# Altium schematic sheet V1.SchDoc
size 558 x 431 mm; SheetNumber: 1; SheetTotal: 1
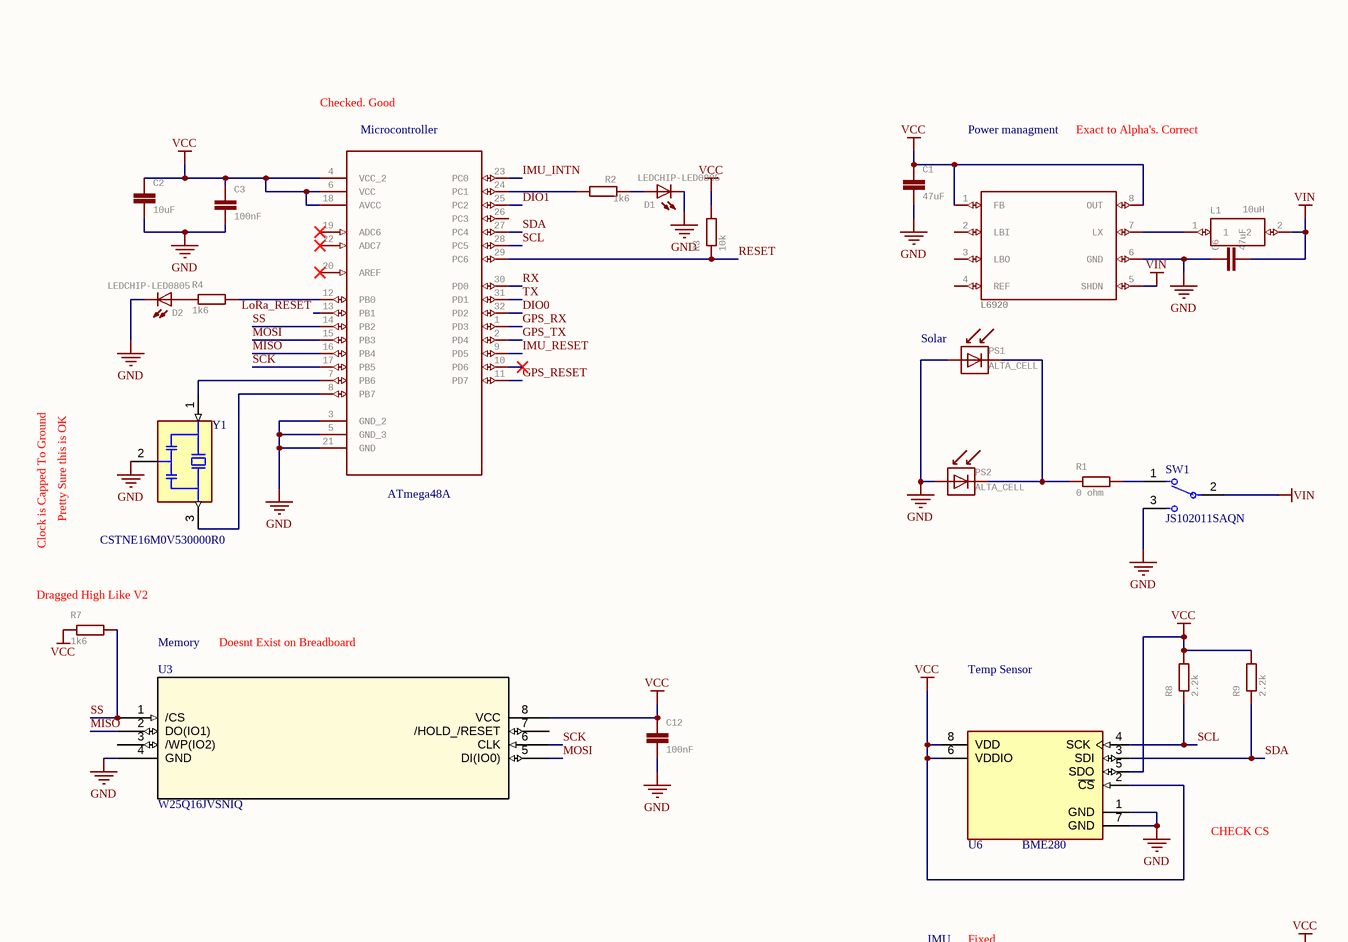
[diagram p0: V1.SchDoc, top left]
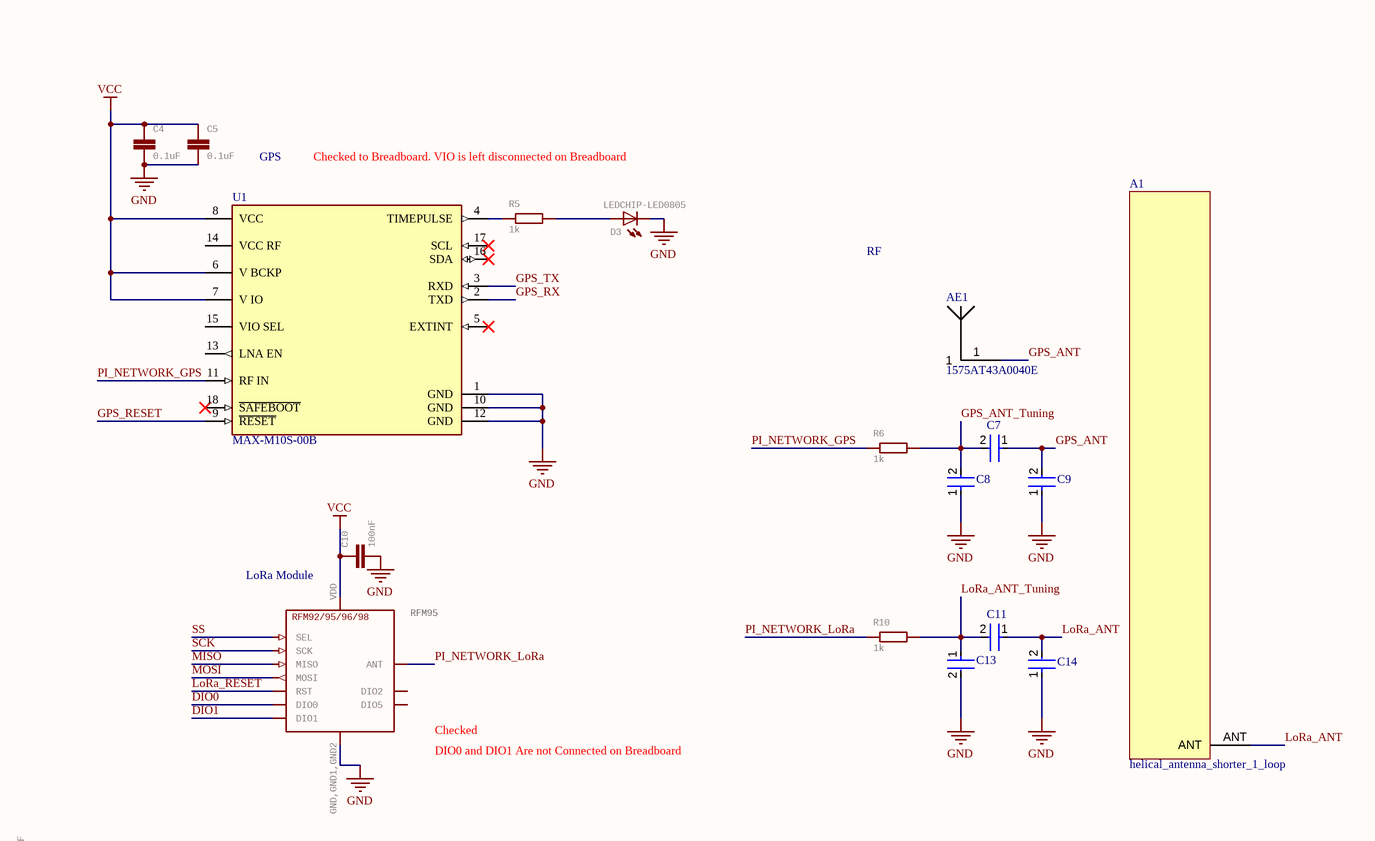
[diagram p1: V1.SchDoc, top right]
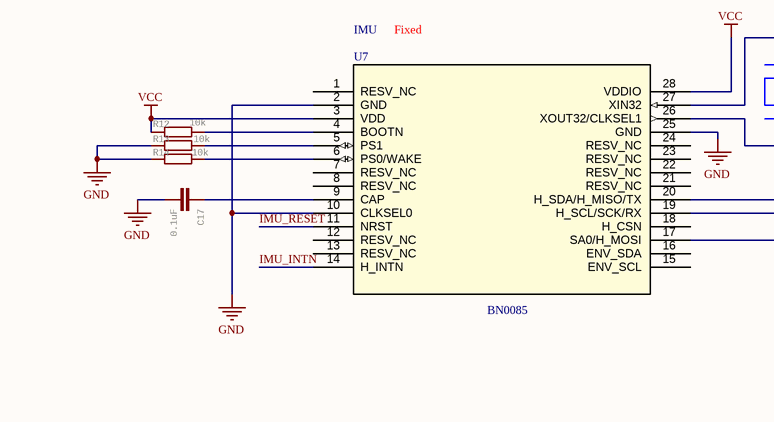
[diagram p2: V1.SchDoc, bottom left]
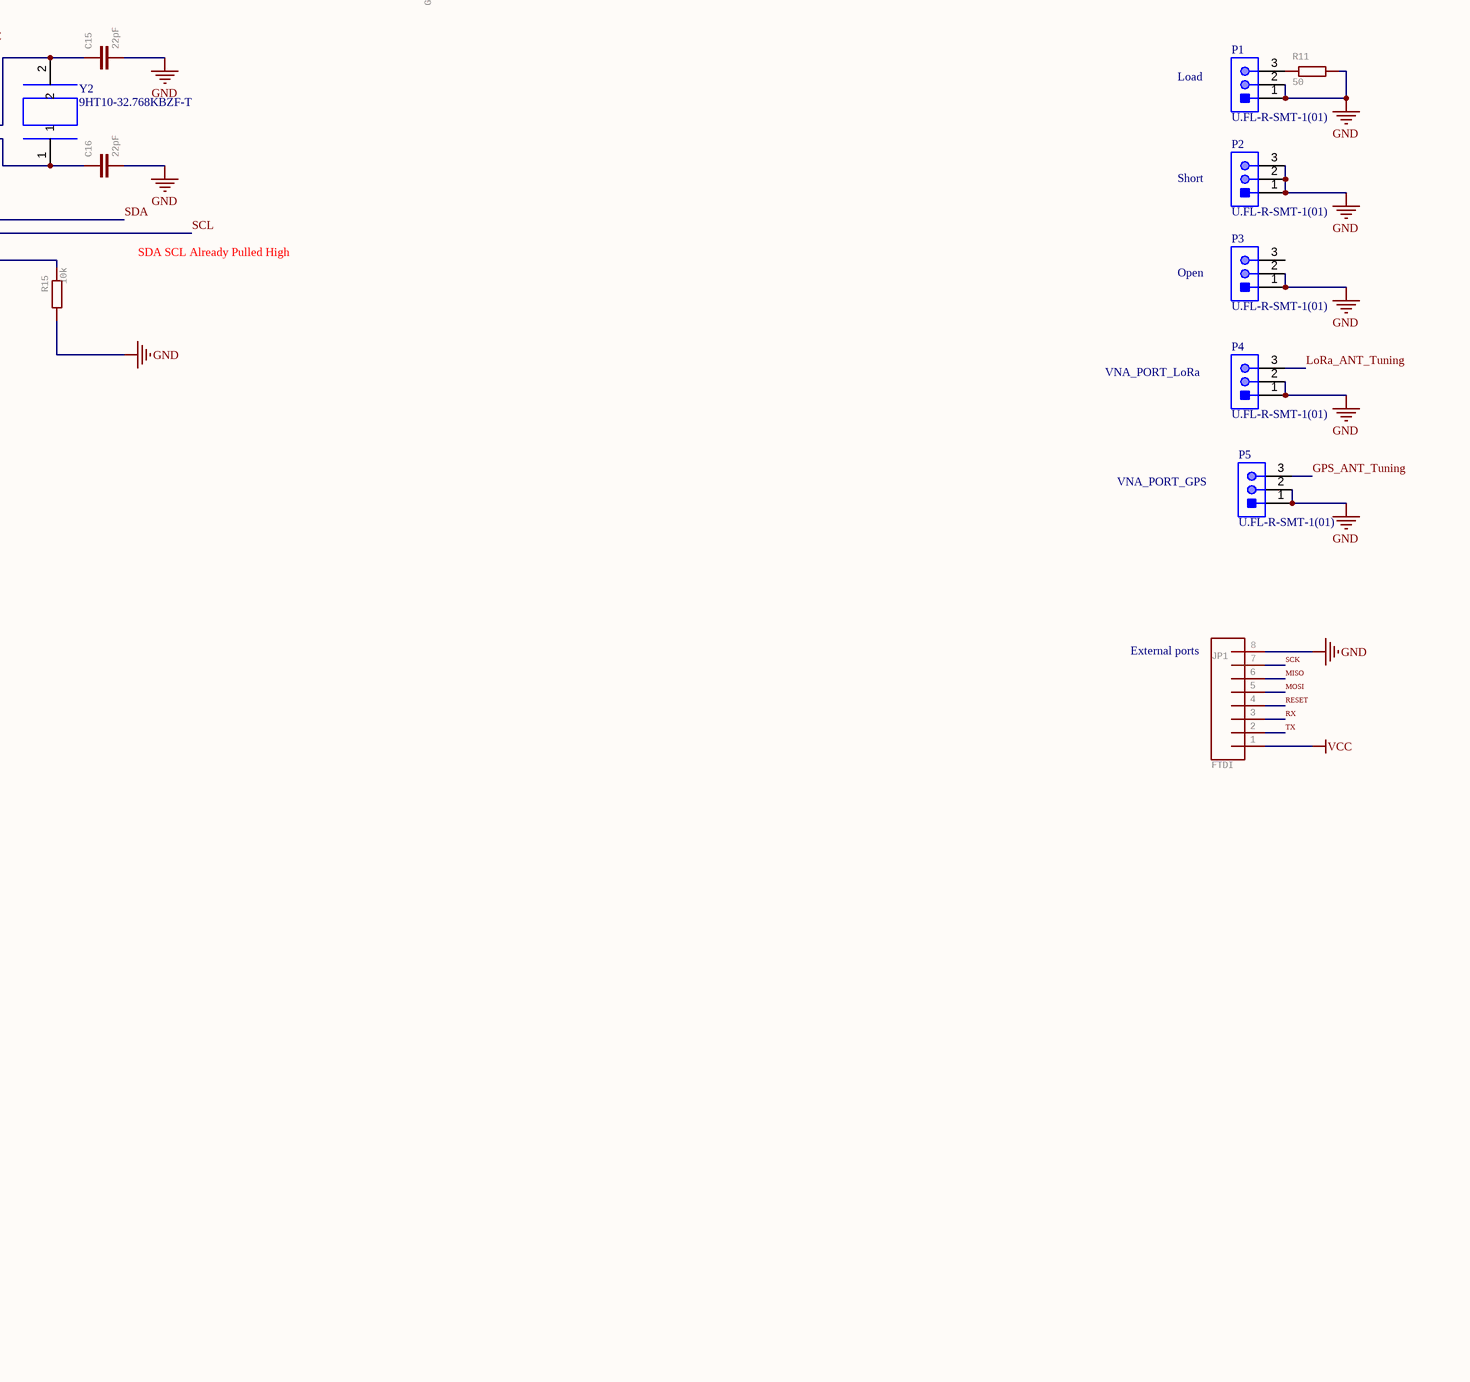
[diagram p3: V1.SchDoc, bottom right]

## Parts
A1  helical_antenna_shorter_1_loop  [LoRa_ANT_915_shorter_1_loop]
AE1  1575AT43A0040E  [ANT_1575AT_JOT-L]
C1  47uF  [RCL_M0805]
C2  10uF  [0402]
C3  100nF  [0402]
C4  0.1uF  [0402]
C5  0.1uF  [0402]
C6  47uF  [RCL_M0805]
C7  C0402C223K8PACTU  [PI_NET_CAPACITOR_0402NO_EXPANSION]  (value not drawn)
C8  C0402C223K8PACTU  [PI_NET_CAPACITOR_0402NO_EXPANSION]  (value not drawn)
C9  C0402C223K8PACTU  [PI_NET_CAPACITOR_0402NO_EXPANSION]  (value not drawn)
C10  100nF  [0402]
C11  C0402C223K8PACTU  [PI_NET_CAPACITOR_0402NO_EXPANSION]  (value not drawn)
C12  100nF  [0402]
C13  C0402C223K8PACTU  [PI_NET_CAPACITOR_0402NO_EXPANSION]  (value not drawn)
C14  C0402C223K8PACTU  [PI_NET_CAPACITOR_0402NO_EXPANSION]  (value not drawn)
C15  22pF  [0402]
C16  22pF  [0402]
C17  0.1uF  [0402]
D1  LEDCHIP-LED0805  [0402]
D2  LEDCHIP-LED0805  [0402]
D3  LEDCHIP-LED0805  [0402]
JP1  FTDI  [1X08_OVAL]
L1  10uH  [Inductor_For_6920]
P1  U.FL-R-SMT-1(01)  [HRS-U.FL-R-SMT-3_V]
P2  U.FL-R-SMT-1(01)  [HRS-U.FL-R-SMT-3_V]
P3  U.FL-R-SMT-1(01)  [HRS-U.FL-R-SMT-3_V]
P4  U.FL-R-SMT-1(01)  [HRS-U.FL-R-SMT-3_V]
P5  U.FL-R-SMT-1(01)  [HRS-U.FL-R-SMT-3_V]
PS1  ALTA_CELL  [ALTA_CELL_SAME_SIZED_FEET]
PS2  ALTA_CELL  [ALTA_CELL_SAME_SIZED_FEET]
R1  0 ohm  [RCL_M0805]
R2  1k6  [0402]
R3  10k  [0402]
R4  1k6  [0402]
R5  1k  [0402]
R6  1k  [0402]
R7  1k6  [0402]
R8  2.2k  [0402]
R9  2.2k  [0402]
R10  1k  [0402]
R11  50  [0402]
R12  10k  [0402]
R13  10k  [0402]
R14  10k  [0402]
R15  10k  [0402]
SW1  JS102011SAQN  [FP-JS102011SAQN-MFG]
U1  MAX-M10S-00B  [FP-MAX-M10S-00B-MFG - duplicate]
U2  ATMEL-ATMEGA328P-AU_ATMEGA328P-AU  [ATMEL-ATMEGA328P-AU_QFP80P900X900X120-32N]  (value not drawn)
U3  W25Q16JVSNIQ  [SOIC_150MIL_WIN]
U4  L6920  [L6920_L6920]
U5  RFM95  [_C2H_RFM95]
U6  d58e2f6669bc67e6a2bc6a28610ca79  [FP-BME280-MFG]  (value not drawn)
U7  BN0085  [QFN28_BNO086_CEV]
Y1  CSTNE16M0V530000R0  [OSC_CSTNE16M0V530000R0]
Y2  9HT10-32.768KBZF-T  [XTAL_9HT10_TXC]

## Nets
GND: C1.2 C2.2 C3.2 C4.2 C5.2 C6.1 C8.1 C9.1 C10.2 C12.2 C13.2 C14.1 C15.2 C16.2 C17.2 D1.2(C) D2.2(C) D3.2(C) JP1.8 P1.1 P1.2 P2.1 P2.2 P2.3 P3.1 P3.2 P4.1 P4.2 P5.1 P5.2 PS1.- PS2.- R11.2 R13.2 R14.2 R15.2 SW1.3 U1.1(GND) U1.10(GND) U1.12(GND) U2.3(GND_2) U2.5(GND_3) U2.21(GND) U3.4(GND) U4.6(GND) U5.GND,GND1,GND2(GND) U6.1(GND) U6.7(GND) U7.2(GND) U7.10(CLKSEL0) U7.25(GND) Y1.2(GND)
VCC: C1.1 C2.1 C3.1 C4.1 C5.1 C10.1 C12.1 JP1.1 R3.2 R7.1 R8.2 R9.2 R12.2 U1.6(V_BCKP) U1.7(V_IO) U1.8(VCC) U2.4(VCC_2) U2.6(VCC) U2.18(AVCC) U3.8(VCC) U4.1(FB) U4.8(OUT) U5.VDD(VCC) U6.2(~{CS}) U6.5(SDO) U6.6(VDDIO) U6.8(VDD) U7.3(VDD) U7.28(VDDIO)
VIN: C6.2 L1.2 SW1.2(C) U4.5(SHDN)
DIO0: U2.32(PD2) U5.DIO0
DIO1: U2.25(PC2) U5.DIO1
GPS_ANT: AE1.1 C7.1 C9.2
GPS_ANT_Tuning: C7.2 C8.2 P5.3 R6.2
GPS_RESET: U1.9(~{RESET}) U2.11(PD7)
GPS_RX: U1.2(TXD) U2.1(PD3)
GPS_TX: U1.3(RXD) U2.2(PD4)
IMU_INTN: U2.23(PC0) U7.14(H_INTN)
IMU_RESET: U2.9(PD5) U7.11(NRST)
LoRa_ANT: A1.ANT C11.1 C14.2
LoRa_ANT_Tuning: C11.2 C13.1 P4.3 R10.2
LoRa_RESET: U2.13(PB1) U5.RST
MISO: JP1.6 U2.16(PB4) U3.2(DO(IO1)) U5.MISO
MOSI: JP1.5 U2.15(PB3) U3.5(DI(IO0)) U5.MOSI
PI_NETWORK_GPS: R6.1 U1.11(RF_IN)
PI_NETWORK_LoRa: R10.1 U5.ANT
RESET: JP1.4 R3.1 U2.29(PC6)
RX: JP1.3 U2.30(PD0)
SCK: JP1.7 U2.17(PB5) U3.6(CLK) U5.SCK
SCL: R8.1 U2.28(PC5) U6.4(SCK) U7.19(H_SCL/SCK/RX)
SDA: R9.1 U2.27(PC4) U6.3(SDI) U7.20(H_SDA/H_MISO/TX)
SS: R7.2 U2.14(PB2) U3.1(/CS) U5.NSS(SEL)
TX: JP1.2 U2.31(PD1)
NetC15_1: C15.1 U7.27(XIN32) Y2.2
NetC16_1: C16.1 U7.26(XOUT32/CLKSEL1) Y2.1
NetC17_1: C17.1 U7.9(CAP)
NetD1_1: D1.1(A) R2.1
NetD2_1: D2.1(A) R4.1
NetD3_1: D3.1(A) R5.2
NetL1_1: L1.1 U4.7(LX)
NetP1_3: P1.3 R11.1
NetPS1_+: PS1.+ PS2.+ R1.1
NetR1_2: R1.2 SW1.1
NetR2_2: R2.2 U2.24(PC1)
NetR4_2: R4.2 U2.12(PB0)
NetR5_1: R5.1 U1.4(TIMEPULSE)
NetR12_1: R12.1 U7.4(BOOTN)
NetR13_1: R13.1 U7.5(PS1)
NetR14_1: R14.1 U7.6(PS0/WAKE)
NetR15_1: R15.1 U7.17(SA0/H_MOSI)
NetU2_7: U2.7(PB6) Y1.1(IN)
NetU2_8: U2.8(PB7) Y1.3(OUT)

Not connected (* = marked no-connect by the designer): P3 3; U1 5(EXTINT)* 13(LNA_EN) 14(VCC_RF) 15(VIO_SEL) 16(SDA)* 17(SCL)* 18(~{SAFEBOOT})*; U2 10(PD6)* 19(ADC6)* 20(AREF)* 22(ADC7)* 26(PC3); U3 3(/WP(IO2)) 7(/HOLD_/RESET); U4 2(LBI) 3(LBO) 4(REF); U5 DIO2 DIO5; U7 1(RESV_NC) 7(RESV_NC) 8(RESV_NC) 12(RESV_NC) 13(RESV_NC) 15(ENV_SCL) 16(ENV_SDA) 18(H_CSN) 21(RESV_NC) 22(RESV_NC) 23(RESV_NC) 24(RESV_NC)

## Notes on the sheet
- Checked. Good
- (near U2) Microcontroller
- Power managment
- Exact to Alpha's. Correct
- GPS
- Checked to Breadboard. VIO is left disconnected on Breadboard
- RF
- (near PS1) Solar
- Clock is Capped To Ground
- Pretty Sure this is OK
- (near U2) ATmega48A
- (near R7) Dragged High Like V2
- Memory
- Doesnt Exist on Breadboard
- Temp Sensor
- LoRa Module
- (near U5) Checked
- (near U6) BME280
- CHECK CS
- (near U5) DIO0 and DIO1 Are not Connected on Breadboard
- IMU
- Fixed
- Load
- (near P2) Short
- SDA SCL Already Pulled High
- Open
- VNA_PORT_LoRa
- VNA_PORT_GPS
- (near JP1) External ports
- DWG. NO.
- REV.
- SHT.
- REVISION
- DESCRIPTION
- DATE
- APPROVED
- THIS DOCUMENT AND THE DATA DISCLOSED HEREIN OR HEREWITH IS THE PROPERTY OF ALTIUM LIMITED AND MAY BE FREELY DISTRIBUTED IN WHOLE. NO RIGHTS ARE RESERVED OR EXPRESS OR IMPLIED WARANTEE GIVEN.
- ENG:
- DSN:
- APPROVALS
- PROJECT
- DOCUMENT REVISION:
- DESIGN ITEM:
- CHK:
- BOM:
- REFERENCE DOCUMENTS
- PROJECT REVISION:
- TITLE
- FAB DWG:
- PCB DWG:
- ASSY DWG:
- SCALE:
- SIZE
- C
- CAGE CODE
- FILE NAME
- DWG NO.
- SHEET
- OF
- REV

## Library data of the parts
A1 = helical_antenna_shorter_1_loop: helical_antenna schematic for the DeSCENT v1 ChipSat
AE1 = 1575AT43A0040E: No Description Available; Mfr_Name: Johanson Technology; Digi-Key_Part_Number_3: 712-1003-6-ND; Digi-Key_Part_Number_2: 712-1003-1-ND; Digi-Key_Part_Number_1: 712-1003-2-ND
C1 C6 = C-EUC0603K_1: CAPACITOR, European symbol; GateName_1: G$1; SymbolName_1: C-EU; DeviceName: C0805K; LibraryName: rcl; DeviceSetName: C-EU
C2-C5 C15-C17 = C-EUC0805K: CAPACITOR, European symbol; GateName_1: G$1; SymbolName_1: C-EU; DeviceName: C0805K; LibraryName: rcl; DeviceSetName: C-EU
C7-C9 C11 C13 C14 = 0402RFCapacitor_NO_SILK: CAP CER 0.022UF 10V X5R 0402; Manufacturer: Kemet; Capacitance: 22,000 pF; Value: 22,000 pF; Temperature Coefficient: 15%; Material: Ceramic; Tolerance: 0.1; RoHS: TRUE; Octopart: https://octopart.com/c0402c223k8pactu-kemet-140074; Category: Cap; Manufacturer Part Number: C0402C223K8PACTU; Lead Free: Yes; Automotive: No; Height: 0.55mm; Ipc Land Pattern Name: CAPC10050X50; ComponentLink2URL: https://content.kemet.com/datasheets/KEM_C1002_X7R_SMD.pdf; Device Class L2: Capacitors; Temperature Range Low: -55°C; ComponentLink2Description: Datasheet; Mouser Description: Multilayer Ceramic Capacitors MLCC - SMD/SMT 10volts 22000pF X5R 10%; Voltage Rating: 10 V; Device Class L3: Ceramic Capacitors; Package: C0402-BB; Digikey Description: CAP CER 0.022UF 10V X5R 0402; Temperature Characteristic: X5R; Temperature: -55°C to +125°C; Device Class L1: Passive Components; Temperature Range High: +125°C
C10 C12 = RCL_C-EUC0805: GateName_1: G$1; DeviceName: C0805; SymbolName_1: RCL_C-EU; LibraryName: AmbaSat-1v1-01-NO-solar; DeviceSetName: RCL_C-EU; Package: RCL_C0805
D1-D3 = LEDCHIP-LED0805: LED   OSRAM: - CHIPLED LG R971, LG N971, LY N971, LG Q971, LY Q971, LO R971, LY R971 LH N974, LH R974 LS Q976, LO Q976, LY Q976 LO Q996 - Hyper CHIPLED LW Q18S LB Q993, LB Q99A, LB R99A - SideLED LS A670, LO A670, LY A670, LG A670, LP A670 LB A673, LV A673, LT A673, LW A673 LH A674 LY A675 LS A676, LA A676, LO A676, LY A676, LW A676 LS A679, LY A679, LG A679 -  Hyper Micro SIDELEDÂ® LS Y876, LA Y876, LO Y876, LY Y876 LT Y87S - SmartLED LW L88C, LW L88S LB L89C, LB L89S, LG L890 LS L89K, LO L89K, LY L89K LS L896, LA L896, LO L896, LY L896 - TOPLED LS T670, LO T670, LY T670, LG T670, LP T670 LSG T670, LSP T670, LSY T670, LOP T670, LYG T670 LG T671, LOG T671, LSG T671 LB T673, LV T673, LT T673, LW T673 LH T674 LS T676, LA T676, LO T676, LY T676, LB T676, LH T676, LSB T676, LW T676 LB T67C, LV T67C, LT T67C, LS T67K, LO T67K, LY T67K, LW E67C LS E67B, LA E67B, LO E67B, LY E67B, LB E67C, LV E67C, LT E67C LW T67C LS T679, LY T679, LG T679 LS T770, LO T770, LY T770, LG T770, LP T770 LB T773, LV T773, LT T773, LW T773 LH T774 LS E675, LA E675, LY E675, LS T675 LS T776, LA T776, LO T776, LY T776, LB T776 LHGB T686 LT T68C, LB T68C - Hyper Mini TOPLEDÂ® LB M676 - Mini TOPLED SantanaÂ® LG M470 LS M47K, LO M47K, LY M47K    Source: http://www.osram.convergy.de   LUXEON: - LUMILEDÂ® LXK2-PW12-R00, LXK2-PW12-S00, LXK2-PW14-U00, LXK2-PW14-V00 LXK2-PM12-R00, LXK2-PM12-S00, LXK2-PM14-U00 LXK2-PE12-Q00, LXK2-PE12-R00, LXK2-PE12-S00, LXK2-PE14-T00, LXK2-PE14-U00 LXK2-PB12-K00, LXK2-PB12-L00, LXK2-PB12-M00, LXK2-PB14-N00, LXK2-PB14-P00, LXK2-PB14-Q00 LXK2-PR12-L00, LXK2-PR12-M00, LXK2-PR14-Q00, LXK2-PR14-R00 LXK2-PD12-Q00, LXK2-PD12-R00, LXK2-PD12-S00 LXK2-PH12-R00, LXK2-PH12-S00 LXK2-PL12-P00, LXK2-PL12-Q00, LXK2-PL12-R00    Source: www.luxeon.com   KINGBRIGHT:   KA-3528ASYC Source: www.kingbright.com; GateName_1: G$1; SymbolName_1: LED; DeviceName: CHIP-LED0805; LibraryName: led; DeviceSetName: LED
JP1 = CONN_06LONGPADS: Multi connection point. Often used as Generic Header-pin footprint for 0.1 inch spaced/style header connections    On any of the 0.1 inch spaced packages, you can populate with these:  Break Away Headers - Straight (PRT-00116)   Break Away Male Headers - Right Angle (PRT-00553)   Female Headers (PRT-00115)   Break Away Headers - Machine Pin (PRT-00117)   Break Away Female Headers - Swiss Machine Pin (PRT-00743)   Arduino Stackable Header - 6 Pin (PRT-09280)        For SCREWTERMINALS and SPRING TERMINALS visit here:  Screw Terimnals on SparkFun.com (5mm/3.5mm/2.54mm spacing)       This device is also useful as a general connection point to wire up your design to another part of your project. Our various solder wires solder well into these plated through hole pads.  Hook-Up Wire - Assortment (Stranded, 22 AWG) (PRT-11375)   Hook-Up Wire - Assortment (Solid Core, 22 AWG) (PRT-11367)   View the entire wire category on our website here; GateName_1: G$1; SymbolName_1: CONN_06; DeviceName: LONGPADS; LibraryName: SparkFun-Connectors; DeviceSetName: CONN_06
L1 = ASPI-0315FS: GateName_1: G$1; SymbolName_1: ASPI-0315FS; LibraryName: ASPI-0315FS; DeviceSetName: ASPI-0315FS
P1-P5 = CN-1P-M-R3: Ultra Small Coaxial Connector, 6 GHz, -40 to 90 degC, 3-Pin SMD, RoHS, Bulk; Manufacturer: Hirose Electric; Connector Style: U.FL; Impedance: 50Ohm; Dielectric Material: LiquidCrystalPolymer(LCP); Minimum Quantity: UltraMiniatureCoaxial; Online Catalog: U.FLSeries; Featured Product: HiroseU.FLSeries; Frequency - Max: 6GHz; Other Names: H122041 / U.FL-R-SMT-1(01)-ND; Contact Termination: Solder; Body Material: PhosphorBronze; Connector Type: Jack,MalePin; Body Finish: Silver; Center Contact Plating: Gold; Manufacturer URL: https://www.hirose.com; Family: CoaxialConnectors(RF); Fastening Type: Snap-On; Unit PriceUSD: U.FL; Series: U.FL; Package Reference: U.FL-R-SMT; Packaging: Bulk; Standard Package: 100; Mounting Type: SurfaceMount; Quantity Available: Bulk; Housing Color: Silver; Package Description: 3-Pin Surface Mount Device, Body 2.6 x 2.6 mm; Category: Connectors,Interconnects; Operating Temperature: -40degC~90degC; Center Contact Material: PhosphorBronze; Dynamic Catalog: U.FLSeries; Datasheet URL: https://datasheet.ciiva.com/26945/getdatasheetpartid-475239-26945414.pdf; Datasheet Version: Feb-09; Shield Termination: Solder
PS1 PS2 = ALTA_CELL: GateName_1: G$1; SymbolName_1: ALTA_CELL; LibraryName: ALTA_CELL; DeviceSetName: ALTA_CELL
R1 = R-EU_M0805: Larger Resistor for Solar; GateName_1: G$1; SymbolName_1: R-EU; DeviceName: M0805; DeviceSetName: R-EU_; LibraryName: rcl
R2-R15 = R-EU_M0805: RESISTOR, European symbol; GateName_1: G$1; SymbolName_1: R-EU; DeviceName: M0805; DeviceSetName: R-EU_; LibraryName: rcl
SW1 = CMP-2000-06501-2: SWITCH SLIDE SPDT 300MA 6V; Switch Function: On-On; Illumination Type: Non-Illuminated; Switch Travel: 2mm; Contact Resistance: 70mR; Actuator Material: Nylon; Electrical Life: 5000Cycles; Actuator Type: Standard; Max Operating Temperature: 85°C; Housing Material: Nylon; Radiation Hardening: No; Max Voltage Rating (DC): 6V; Package Quantity: 1; Case/Package: 100; Actuator Length: 2mm; Min Operating Temperature: -40°C; Contact Current Rating: 300mA; REACH SVHC: No SVHC; Throw Configuration: SPDT; Packaging: Tape and Reel; Contact Material: Copper Alloy; Max Current Rating: 300mA; Current Rating: 300mA; Mount: Surface Mount; Lead Free: Lead Free; Termination: Gull Wing; Voltage Rating (DC): 6V; Length: 9mm; Orientation: Right Angle; Contact Plating: Silver
U1 = CMP-207130-000026-1: GNSS LCC RX, ROM, TCXO, LNA, SAW
U2 = ATMEL-ATMEGA328P-AU_ATMEGA328P-AU: GateName_1: A; SymbolName_1: ATMEL-ATMEGA328P-AU_ATMEGA328P-AU; LibraryName: AmbaSat-1v1-01-NO-solar; DeviceSetName: ATMEL-ATMEGA328P-AU_ATMEGA328P-AU; Package: ATMEL-ATMEGA328P-AU_QFP80P900X900X120-32N; MPN: ATMEGA328P-AU; OC_FARNELL: 1715486; OC_NEWARK: 14R4631; PACKAGE: TQFP-32; SUPPLIER: Atmel
U3 = W25Q16JVSNIQ: NOR Flash; Mfr_Name: Winbond; RefDes: RefDes; Type: Type
U4 = L6920: Voltage stepper upper L6920DTR model; GateName_1: G$1; SymbolName_1: L6920; LibraryName: L6920; DeviceSetName: L6920
U5 = RFM95: LoRa chip; pin to pad: GND,GND1,GND2>GND+GND1+GND2; GateName_1: G$1; SymbolName_1: RFM95; LibraryName: _c2h; DeviceSetName: RFM95; RFM92/95/96/98: RFM92/95/96/98
U6 = d58e2f6669bc67e6a2bc6a28610ca79: Temp and huminity sensor
U7 = BNO086: No Description Available; Mfr_Name: CEVA; Type: Motion Sensors; RefDes: RefDes
Y1 = CSTNE16M0V530000R0: 16MHz Ceramic Resonator Built in Capacitor 15pF Â±0.15% 40 Ohms -40Â°C ~ 125Â°C Surface Mount; MF: {'manufacturer': u'Murata Electronics'}; Value: *; Availability: Unavailable; MP: CSTNE16M0V530000R0; Price: None; Package: None
Y2 = 9HT10-32.768KBZF-T: 32.768 kHz Â±50ppm Crystal 12.5pF 70 kOhms 2-SMD, No Lead; MF: TXC; SnapEDA_Link: https://www.snapeda.com/parts/9HT10-32.768KBZF-T/TXC/view-part/?ref=snap; Package: SMD-2 TXC Corporation; Value: *; MP: 9HT10-32.768KBZF-T; Check_prices: https://www.snapeda.com/parts/9HT10-32.768KBZF-T/TXC/view-part/?ref=eda; ComponentLink1Description: New link; ComponentLink1URL: *